# Altium schematic sheet Sheet1.SchDoc
size A; SheetNumber: 1; SheetTotal: 1
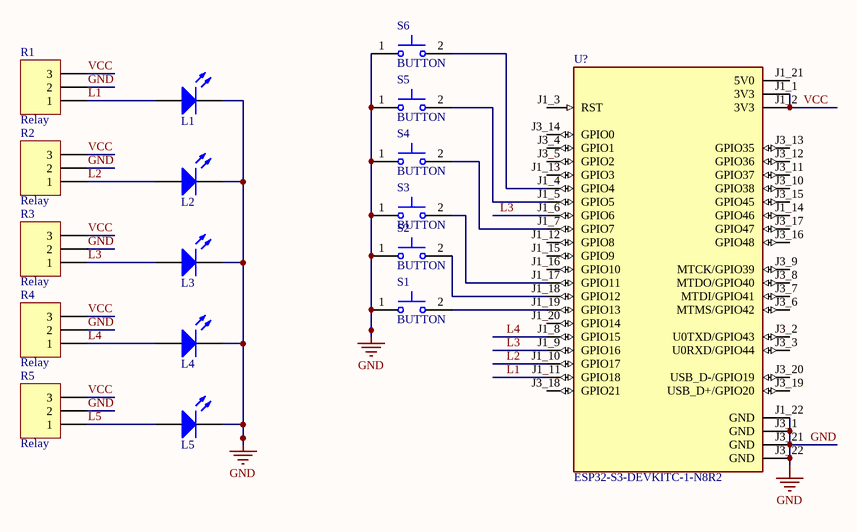
[diagram p0: Sheet1.SchDoc]

## Parts
L1  LED 0805 SMD  [LED 0805 SMD]  (value not drawn)
L2  LED 0805 SMD  [LED 0805 SMD]  (value not drawn)
L3  LED 0805 SMD  [LED 0805 SMD]  (value not drawn)
L4  LED 0805 SMD  [LED 0805 SMD]  (value not drawn)
L5  LED 0805 SMD  [LED 0805 SMD]  (value not drawn)
R1  Relay  [HDR1X3]
R2  Relay  [HDR1X3]
R3  Relay  [HDR1X3]
R4  Relay  [HDR1X3]
R5  Relay  [HDR1X3]
S1  BUTTON  [SW_BUTT-2 pin]
S2  BUTTON  [SW_BUTT-2 pin]
S3  BUTTON  [SW_BUTT-2 pin]
S4  BUTTON  [SW_BUTT-2 pin]
S5  BUTTON  [SW_BUTT-2 pin]
S6  BUTTON  [SW_BUTT-2 pin]
U?  ESP32-S3-DEVKITC-1-N8R2  [XCVR_ESP32-S3-DEVKITC-1-N8R2]

## Nets
GND: L1.2(K) L2.2(K) L3.2(K) L4.2(K) L5.2(K) R1.2 R2.2 R3.2 R4.2 R5.2 S1.1 S2.1 S3.1 S4.1 S5.1 S6.1 U?.J1_22(GND) U?.J3_1(GND) U?.J3_21(GND) U?.J3_22(GND)
L1: L1.1(A) R1.1 U?.J1_11(GPIO18)
L2: L2.1(A) R2.1 U?.J1_10(GPIO17)
L3: L3.1(A) R3.1 U?.J1_6(GPIO6) U?.J1_9(GPIO16)
L4: L4.1(A) R4.1 U?.J1_8(GPIO15)
L5: L5.1(A) R5.1
VCC: R1.3 R2.3 R3.3 R4.3 R5.3 U?.J1_1(3V3) U?.J1_2(3V3)
NetS1_2: S1.2 U?.J1_19(GPIO13)
NetS2_2: S2.2 U?.J1_18(GPIO12)
NetS3_2: S3.2 U?.J1_17(GPIO11)
NetS4_2: S4.2 U?.J1_7(GPIO7)
NetS5_2: S5.2 U?.J1_5(GPIO5)
NetS6_2: S6.2 U?.J1_4(GPIO4)

Not connected (* = marked no-connect by the designer): U? J1_3(RST) J1_12(GPIO8) J1_13(GPIO3) J1_14(GPIO46) J1_15(GPIO9) J1_16(GPIO10) J1_20(GPIO14) J1_21(5V0) J3_2(U0TXD/GPIO43) J3_3(U0RXD/GPIO44) J3_4(GPIO1) J3_5(GPIO2) J3_6(MTMS/GPIO42) J3_7(MTDI/GPIO41) J3_8(MTDO/GPIO40) J3_9(MTCK/GPIO39) J3_10(GPIO38) J3_11(GPIO37) J3_12(GPIO36) J3_13(GPIO35) J3_14(GPIO0) J3_15(GPIO45) J3_16(GPIO48) J3_17(GPIO47) J3_18(GPIO21) J3_19(USB_D+/GPIO20) J3_20(USB_D-/GPIO19)

## Library data of the parts
L1-L5 = LED 0805 SMD: Green 571nm LED Indication - Discrete 2V 0805 (2012 Metric); Supplier 1: Digi-Key; Supplier Part Number 1: 160-1426-1-ND; Value: LED 0805 SMD
R1-R5 = Header 3X1: CONN HEADER 3POS .100" SINGL TIN; LatestRevisionDate: 17-Jul-2002; LatestRevisionNote: Re-released for DXP Platform.; Publisher: Altium Limited; Supplier 1: Digi-Key; Supplier Part Number 1: SAM1035-03-ND; Value: Relay
S1-S6 = BUTT-2: Tactile Switches MINI PUSH BUTTON SWITCH 2-PIN QTY. 4; MF: Gravitech; Mouser-Purchase-URL: https://snapeda.com/shop?store=Mouser&id=885822; Price: None; Package: None; Value: *; MP: BUTT-2; SnapEDA_Link: https://www.snapeda.com/parts/BUTT-2/Gravitech/view-part/885822/?ref=snap; Availability: Warning
U? = ESP32-S3-DEVKITC-1-N8R2: WiFi Development Tools - 802.11 (Engineering Samples Only) ESP32-S3 General-Purpose Development Board, ESP32-S3-WROOM-1-N8R2, with Pin Header; MF: Espressif Systems; SnapEDA_Link: https://www.snapeda.com/parts/ESP32-S3-DEVKITC-1-N8R2/Espressif+Systems/view-part/?ref=snap; Package: None; Value: *; MP: ESP32-S3-DEVKITC-1-N8R2; Check_prices: https://www.snapeda.com/parts/ESP32-S3-DEVKITC-1-N8R2/Espressif+Systems/view-part/?ref=eda